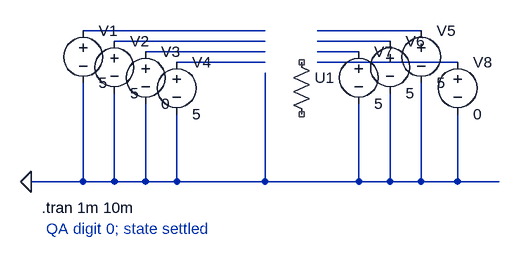
[diagram p0: schematic digit-0.asc]
digit-0.asc, the LTspice schematic file:
Version 4
SHEET 1 880 680
WIRE 160 288 440 288
WIRE 208 304 440 304
WIRE 256 320 440 320
WIRE 304 336 440 336
WIRE 520 288 680 288
WIRE 520 304 632 304
WIRE 520 320 584 320
WIRE 520 336 736 336
WIRE 440 352 440 520
WIRE 160 368 160 520
WIRE 208 384 208 520
WIRE 256 400 256 520
WIRE 304 416 304 520
WIRE 680 368 680 520
WIRE 632 384 632 520
WIRE 584 400 584 520
WIRE 736 416 736 520
WIRE 80 520 800 520
FLAG 80 520 0
SYMBOL res 480 320 R0
SYMATTR InstName U1
SYMATTR Value ""
SYMATTR TauKind sevenSeg
SYMATTR TauValue ""
SYMATTR TauLabel U1
SYMBOL voltage 160 272 R0
SYMATTR InstName V1
SYMATTR Value 5
SYMBOL voltage 208 288 R0
SYMATTR InstName V2
SYMATTR Value 5
SYMBOL voltage 256 304 R0
SYMATTR InstName V3
SYMATTR Value 0
SYMBOL voltage 304 320 R0
SYMATTR InstName V4
SYMATTR Value 5
SYMBOL voltage 680 272 R0
SYMATTR InstName V5
SYMATTR Value 5
SYMBOL voltage 632 288 R0
SYMATTR InstName V6
SYMATTR Value 5
SYMBOL voltage 584 304 R0
SYMATTR InstName V7
SYMATTR Value 5
SYMBOL voltage 736 320 R0
SYMATTR InstName V8
SYMATTR Value 0
TEXT 96 560 Left 2 !.tran 1m 10m
TEXT 96 592 Left 2 ; QA digit 0; state settled

The netlist it stands for:
* digit-0.asc
R§U1 NC_01 NC_02
V1 N001 0 5
V2 N002 0 5
V3 N003 0 0
V4 N004 0 5
V5 N005 0 5
V6 N006 0 5
V7 N007 0 5
V8 N008 0 0
.tran 1m 10m
*  QA digit 0; state settled
.backanno
.end